# EAGLE design H3_MIDIController_Rev_1_MainBoard (EAGLE 7.6.0)
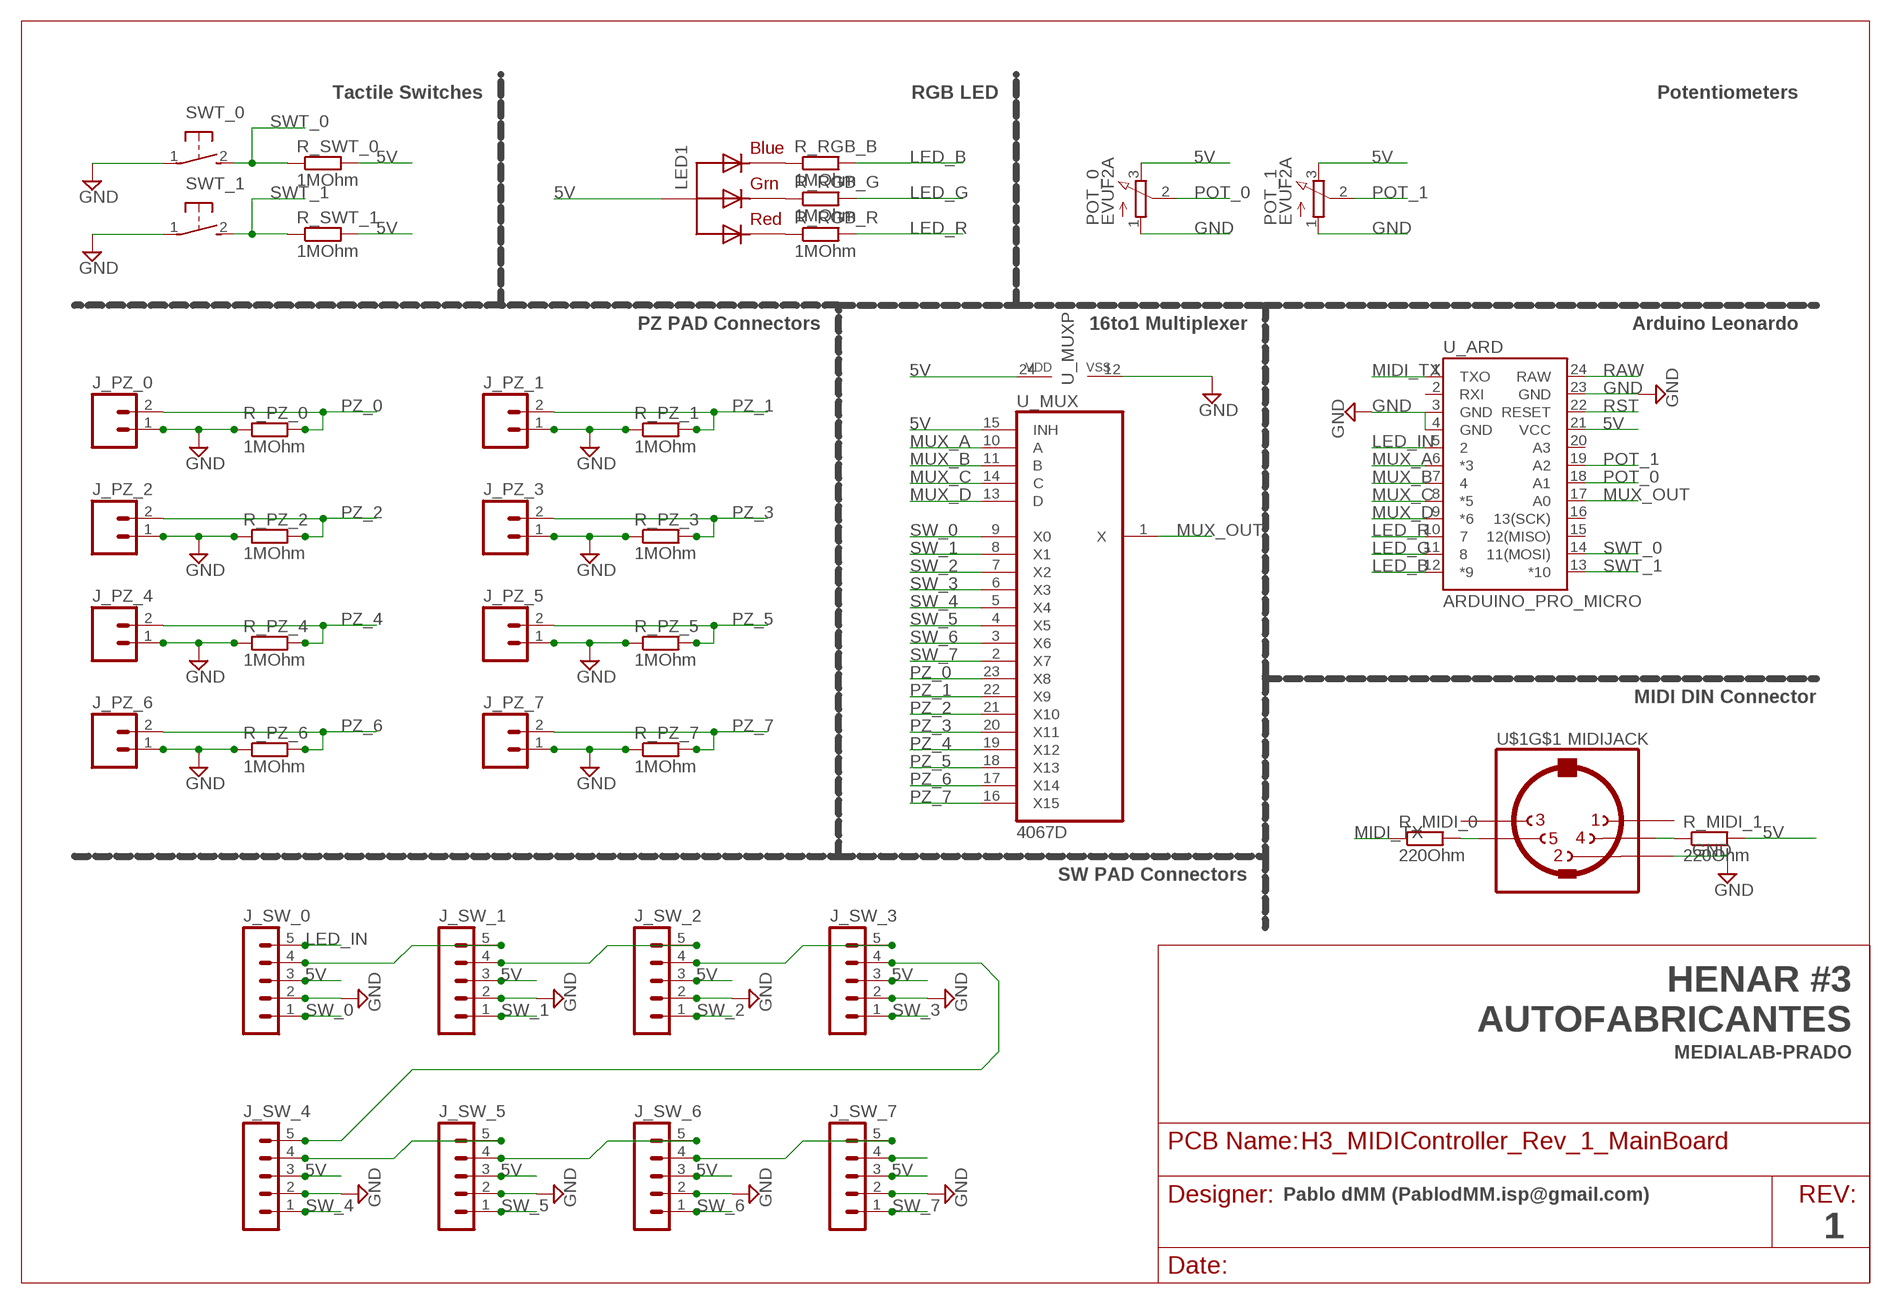
[diagram p0: schematic, sheet 1]

## Parts
J_PZ_0  MA02  [02PA]
J_PZ_1  MA02  [02PA]
J_PZ_2  MA02  [02PA]
J_PZ_3  MA02  [02PA]
J_PZ_4  MA02  [02PA]
J_PZ_5  MA02  [02PA]
J_PZ_6  MA02  [02PA]
J_PZ_7  MA02  [02PA]
J_SW_0  MA05-1  [MA05-1]
J_SW_1  MA05-1  [MA05-1]
J_SW_2  MA05-1  [MA05-1]
J_SW_3  MA05-1  [MA05-1]
J_SW_4  MA05-1  [MA05-1]
J_SW_5  MA05-1  [MA05-1]
J_SW_6  MA05-1  [MA05-1]
J_SW_7  MA05-1  [MA05-1]
LED1  RGBLED_CA-5MM  [LED5MMRGB]
POT_0  EVUF2A  [EVUF]
POT_1  EVUF2A  [EVUF]
R_MIDI_0  220Ohm  R-EU_M1206  [M1206]
R_MIDI_1  220Ohm  R-EU_M1206  [M1206]
R_PZ_0  1MOhm  R-EU_M1206  [M1206]
R_PZ_1  1MOhm  R-EU_M1206  [M1206]
R_PZ_2  1MOhm  R-EU_M1206  [M1206]
R_PZ_3  1MOhm  R-EU_M1206  [M1206]
R_PZ_4  1MOhm  R-EU_M1206  [M1206]
R_PZ_5  1MOhm  R-EU_M1206  [M1206]
R_PZ_6  1MOhm  R-EU_M1206  [M1206]
R_PZ_7  1MOhm  R-EU_M1206  [M1206]
R_RGB_B  1MOhm  R-EU_M1206  [M1206]
R_RGB_G  1MOhm  R-EU_M1206  [M1206]
R_RGB_R  1MOhm  R-EU_M1206  [M1206]
R_SWT_0  1MOhm  R-EU_M1206  [M1206]
R_SWT_1  1MOhm  R-EU_M1206  [M1206]
SWT_0  31-XX  [B3F-31XX]
SWT_1  31-XX  [B3F-31XX]
U$1  MIDIJACK  [CP-2350]
U_ARD  ARDUINO_PRO_MICRO  [ARDUINO_PRO_MICRO]
U_MUX  4067D  [SO24W]

## Nets
5V: J_SW_0.3 J_SW_1.3 J_SW_2.3 J_SW_3.3 J_SW_4.3 J_SW_5.3 J_SW_6.3 J_SW_7.3 LED1.2(VCC) POT_0.3(E) POT_1.3(E) R_MIDI_1.2 R_SWT_0.2 R_SWT_1.2 U_ARD.21(VCC) U_MUX.15(INH) U_MUX.24(VDD)
GND: J_PZ_0.1 J_PZ_1.1 J_PZ_2.1 J_PZ_3.1 J_PZ_4.1 J_PZ_5.1 J_PZ_6.1 J_PZ_7.1 J_SW_0.2 J_SW_1.2 J_SW_2.2 J_SW_3.2 J_SW_4.2 J_SW_5.2 J_SW_6.2 J_SW_7.2 POT_0.1(A) POT_1.1(A) R_PZ_0.1 R_PZ_1.1 R_PZ_2.1 R_PZ_3.1 R_PZ_4.1 R_PZ_5.1 R_PZ_6.1 R_PZ_7.1 SWT_0.1(P) SWT_1.1(P) U$1.2 U_ARD.3(GND) U_ARD.4(GND) U_ARD.23(GND) U_MUX.12(VSS)
LED_B: R_RGB_B.2 U_ARD.12(*9)
LED_G: R_RGB_G.2 U_ARD.11
LED_IN: J_SW_0.5 U_ARD.5
LED_R: R_RGB_R.2 U_ARD.10
MIDI_TX: R_MIDI_0.1 U_ARD.1(TXO)
MUX_A: U_ARD.6(*3) U_MUX.10(A)
MUX_B: U_ARD.7 U_MUX.11(B)
MUX_C: U_ARD.8(*5) U_MUX.14(C)
MUX_D: U_ARD.9(*6) U_MUX.13(D)
MUX_OUT: U_ARD.17(A0) U_MUX.1(X)
N$1: J_SW_1.4 J_SW_2.5
N$2: J_SW_0.4 J_SW_1.5
N$3: LED1.1(RED) R_RGB_R.1
N$4: J_SW_2.4 J_SW_3.5
N$5: R_MIDI_0.2 U$1.5
N$6: J_SW_3.4 J_SW_4.5
N$7: LED1.3(GREEN) R_RGB_G.1
N$8: J_SW_4.4 J_SW_5.5
N$9: J_SW_5.4 J_SW_6.5
N$10: R_MIDI_1.1 U$1.4
N$11: J_SW_6.4 J_SW_7.5
N$12: LED1.4(BLUE) R_RGB_B.1
N$13: J_SW_7.4
POT_0: POT_0.2(S) U_ARD.18(A1)
POT_1: POT_1.2(S) U_ARD.19(A2)
PZ_0: J_PZ_0.2 R_PZ_0.2 U_MUX.23(X8)
PZ_1: J_PZ_1.2 R_PZ_1.2 U_MUX.22(X9)
PZ_2: J_PZ_2.2 R_PZ_2.2 U_MUX.21(X10)
PZ_3: J_PZ_3.2 R_PZ_3.2 U_MUX.20(X11)
PZ_4: J_PZ_4.2 R_PZ_4.2 U_MUX.19(X12)
PZ_5: J_PZ_5.2 R_PZ_5.2 U_MUX.18(X13)
PZ_6: J_PZ_6.2 R_PZ_6.2 U_MUX.17(X14)
PZ_7: J_PZ_7.2 R_PZ_7.2 U_MUX.16(X15)
RAW: U_ARD.24(RAW)
RST: U_ARD.22(RESET)
SW_0: J_SW_0.1 U_MUX.9(X0)
SW_1: J_SW_1.1 U_MUX.8(X1)
SW_2: J_SW_2.1 U_MUX.7(X2)
SW_3: J_SW_3.1 U_MUX.6(X3)
SW_4: J_SW_4.1 U_MUX.5(X4)
SW_5: J_SW_5.1 U_MUX.4(X5)
SW_6: J_SW_6.1 U_MUX.3(X6)
SW_7: J_SW_7.1 U_MUX.2(X7)
SWT_0: R_SWT_0.1 SWT_0.2(S) U_ARD.14(11(MOSI))
SWT_1: R_SWT_1.1 SWT_1.2(S) U_ARD.13(*10)
Unconnected: U$1.1 U$1.3 U$1.PE1(MT) U$1.PE2(MT) U$1.PE(MT) U$1.PE@(MT) U_ARD.2(RXI) U_ARD.15(12(MISO)) U_ARD.16(13(SCK)) U_ARD.20(A3)

## Notes on the sheet
- Tactile Switches | RGB LED | Potentiometers
- PZ PAD Connectors | 16to1 Multiplexer | Arduino Leonardo
- MIDI DIN Connector
- SW PAD Connectors
- HENAR #3
  AUTOFABRICANTES
- MEDIALAB-PRADO
- Pablo dMM (PablodMM.isp@gmail.com)
- 1

## Library data of the parts
J_PZ_0 J_PZ_1-J_PZ_7 = con-amp-quick:MA02: AMP QUICK CONNECTOR; OC_FARNELL: unknown; OC_NEWARK: unknown
J_SW_0 J_SW_1-J_SW_7 = con-lstb:MA05-1: PIN HEADER; OC_FARNELL: unknown; OC_NEWARK: unknown
LED1 = adafruit:RGBLED_CA: RGB LED, common-anode 5MM Staggered pins 5mm Piranha package http://www.ladyada.net/library/pcb/eaglelibrary.html
POT_0 POT_1 = pot:EVU: 9 mm Square Rotary Potentiometers Source: Panasonic
R_MIDI_0 R_MIDI_1 R_PZ_0 R_PZ_1-R_PZ_7 R_RGB_B R_RGB_G R_RGB_R R_SWT_0 R_SWT_1 = rcl:R-EU_: RESISTOR, European symbol
SWT_0 SWT_1 = switch-omron:31-XX: OMRON SWITCH; MPN: B3F-3100; OC_FARNELL: 959704; OC_NEWARK: 36M3582
U$1 = adafruit:MIDIJACK: DIN 5 jack also known as MIDI jack A modification of conn-hirshman:MAB5SH with two options for the grounding 'teeth'
U_ARD = SparkFun-Boards:ARDUINO_PRO_MICRO
U_MUX = 40xx:4067: 16-channel ANALOG MULTIPLEXER

## Board
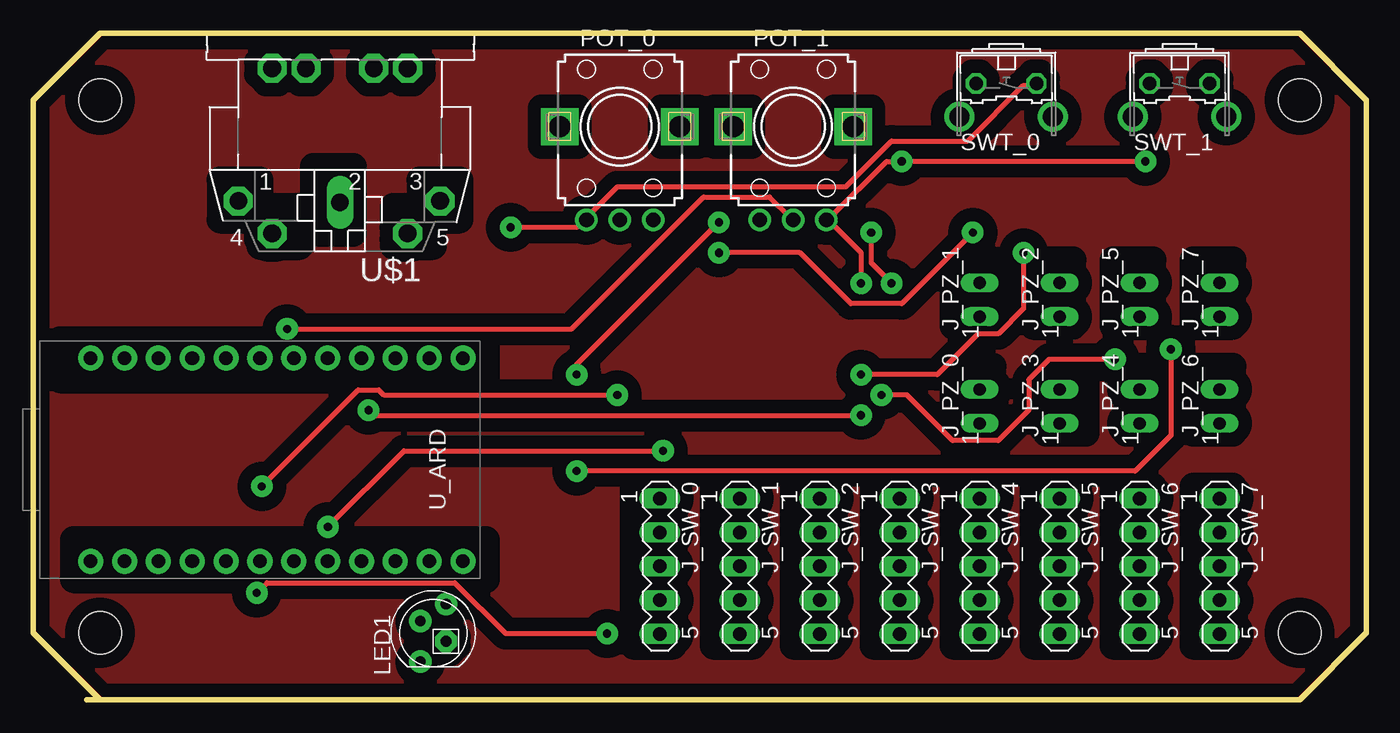
[diagram p1: board, top side]
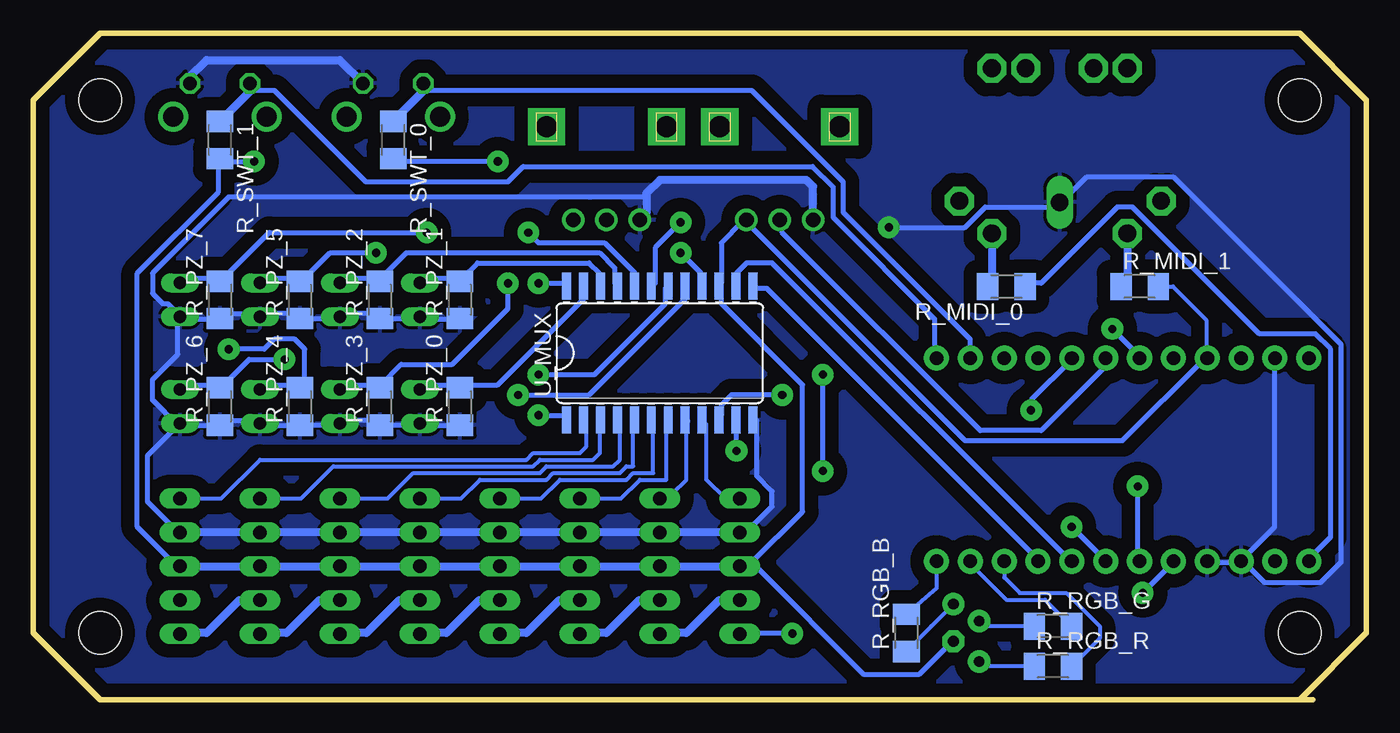
[diagram p2: board, bottom side, seen from below]

Size 100 x 50 mm. Coordinates in mm from the lower left corner, seen from the top.
Outline: 5,0 4,0 95,0
Outline: 5,0 95,0
Outline: 5,0 0,5 0,45 5,50 95,50 100,45 100,5 95,0
Copper layers (1*16): Top 0.035mm / dielectric 1.5mm / Bottom 0.035mm
Design rules "default *": minimum track width 15mil, minimum drill 24mil, track to track 15mil, track to pad 15mil, pad to pad 15mil, via to via 15mil, smd to smd 8mil, copper to edge 20mil, drill to drill 8mil, minimum pad ring 10mil, minimum via ring 20mil, stop-mask expansion 4mil, vias tented up to drill 0mil, thermal gap 10mil
Holes 3.2 mm at 5,45 5,5 95,5 95,45
tRestrict: area 2,24 to 34,27; area 3,9 to 34,12; area 45,4 to 48,16; area 51,4 to 54,16; area 57,4 to 60,16; area 63,4 to 66,16; area 69,4 to 72,16; area 75,4 to 78,16; area 81,4 to 84,16; area 87,4 to 90,16; area 69,28 to 72,33; area 75,28 to 78,33; 12 more areas
vRestrict: area 45,20 to 61,32

### Footprints (pad centres in the part's own frame; a part is rotated, then mirrored left to right if it is on the bottom)
02PA = drill 0.914 long: 1 -1.27,0; 2 1.27,0
MA05-1 = drill 1.016 long: 1 -5.08,0; 2 -2.54,0; 3 0,0; 4 2.54,0; 5 5.08,0
LED5MMRGB = drill 0.8 pad 1.676: 1 -2.159,0.968; 3 0.889,0.968; 4 2.159,-0.968 | drill 0.8 pad 1.676 octagon: 2 -0.635,-0.968
EVUF = drill 1.1 pad 1.676: 1 -2.5,-7; 2 0,-7; 3 2.5,-7 | drill 1.6 pad 2.8 square: M1 4.5,0; M2 -4.5,0
M1206 = smd 1.6 x 2: 1 -1.4,0; 2 1.4,0
B3F-31XX = drill 1.016 octagon: 1 -2.261,-1.245; 2 2.261,-1.245 | drill 1.499 pad 2.159: 3 -3.505,1.245; 4 3.505,1.245
CP-2350 = drill 1.321 pad 2.184 octagon: 1 7.62,12.58; 3 -7.52,12.58; 4 5.08,15.02; 5 -5.08,15.02; PE -2.54,2.62; PE1 -5.08,2.62; PE2 5.08,2.62; PE@ 2.54,2.62 | drill 1.321 long: 2 0,12.68
ARDUINO_PRO_MICRO = drill 1.016 pad 1.88: 1 -7.62,12.7; 2 -7.62,10.16; 3 -7.62,7.62; 4 -7.62,5.08; 5 -7.62,2.54; 6 -7.62,0; 7 -7.62,-2.54; 8 -7.62,-5.08; 9 -7.62,-7.62; 10 -7.62,-10.16; 11 -7.62,-12.7; 12 -7.62,-15.24; 13 7.62,-15.24; 14 7.62,-12.7; 15 7.62,-10.16; 16 7.62,-7.62; 17 7.62,-5.08; 18 7.62,-2.54; 19 7.62,0; 20 7.62,2.54; 21 7.62,5.08; 22 7.62,7.62; 23 7.62,10.16; 24 7.62,12.7
SO24W = smd 0.66 x 2.032: 1 -6.985,-5.029; 2 -5.715,-5.029; 3 -4.445,-5.029; 4 -3.175,-5.029; 5 -1.905,-5.029; 6 -0.635,-5.029; 7 0.635,-5.029; 8 1.905,-5.029; 9 3.175,-5.029; 10 4.445,-5.029; 11 5.715,-5.029; 12 6.985,-5.029; 13 6.985,5.029; 14 5.715,5.029; 15 4.445,5.029; 16 3.175,5.029; 17 1.905,5.029; 18 0.635,5.029; 19 -0.635,5.029; 20 -1.905,5.029; 21 -3.175,5.029; 22 -4.445,5.029; 23 -5.715,5.029; 24 -6.985,5.029

### Placement (x,y rotation side)
J_PZ_0  71,22 90 top
J_PZ_1  71,30 90 top
J_PZ_2  77,30 90 top
J_PZ_3  77,22 90 top
J_PZ_4  83,22 90 top
J_PZ_5  83,30 90 top
J_PZ_6  89,22 90 top
J_PZ_7  89,30 90 top
J_SW_0  47,10 270 top
J_SW_1  53,10 270 top
J_SW_2  59,10 270 top
J_SW_3  65,10 270 top
J_SW_4  71,10 270 top
J_SW_5  77,10 270 top
J_SW_6  83,10 270 top
J_SW_7  89,10 270 top
LED1  30,5 90 top
POT_0  44,43 0 top
POT_1  57,43 0 top
R_MIDI_0  27,31 180 bottom
R_MIDI_1  17,31 0 bottom
R_PZ_0  68,22 90 bottom
R_PZ_1  68,30 90 bottom
R_PZ_2  74,30 90 bottom
R_PZ_3  74,22 90 bottom
R_PZ_4  80,22 90 bottom
R_PZ_5  80,30 90 bottom
R_PZ_6  86,22 90 bottom
R_PZ_7  86,30 90 bottom
R_RGB_B  34.5,5 90 bottom
R_RGB_G  23.5,5.5 0 bottom
R_RGB_R  23.5,2.5 0 bottom
R_SWT_0  73,42 270 bottom
R_SWT_1  86,42 270 bottom
SWT_0  73,45 180 top
SWT_1  86,45 180 top
U$1  23,50 180 top
U_ARD  17,18 90 top
U_MUX  53,26 0 bottom

### Tracks (layer width: path | path; a pad name or v marks a point on that pad's centre or on a via)
5V  (via drill 0.61)
  Top 0.381: v62.1,31.24 62.1,33.53 59.82,35.81 POT_1.3 59.82,36.2 64.01,40.39 v65.15,40.39 v83.44,40.39
  Bottom 0.305: R_MIDI_1.2 14.5,31 12,28.5 12,25.7 U_ARD.21
  Bottom 0.381: v65.15,40.39 72.77,40.39 R_SWT_0.2 | v62.1,31.24 60.2,31.24 U_MUX.24 | J_SW_7.3 89.15,9.91 92.2,12.95 92.2,32 86.11,38.1 86.11,40.39 R_SWT_1.2 85.72,40.39 v83.44,40.39 | LED1.2 31.24,4.19 33.53,1.91 37.72,1.91 45.72,9.91 J_SW_0.3 46.1,10.29 42.29,14.1 42.29,23.62 48.39,29.72 48.39,30.86 U_MUX.15 48.39,31.24 48.39,34.29 46.86,35.81 POT_0.3 46.48,35.81 30.1,19.43 18.29,19.43 12.19,25.53 U_ARD.21
  Bottom 0.61: J_SW_7.3 J_SW_6.3 J_SW_5.3 J_SW_4.3 J_SW_3.3 J_SW_2.3 J_SW_1.3 J_SW_0.3 46,10
GND  (via drill 0.61)
  Top 0.381: v35.81,35.43 40.77,35.43 41.15,35.81 POT_0.1 41.53,36.2 43.81,38.48 60.96,38.48 64.39,41.91 70.1,41.91 74.3,46.1 75.06,46.1 SWT_0.1
  Bottom 0.381: J_PZ_7.1 88.77,28.57 86.11,28.57 R_PZ_7.1 85.72,28.96 83.06,28.96 J_PZ_5.1 82.68,28.96 80.01,28.96 R_PZ_5.1 79.63,28.57 77.34,28.57 J_PZ_2.1 76.96,28.96 74.3,28.96 R_PZ_2.1 73.91,28.57 71.25,28.57 J_PZ_1.1 70.87,28.57 68.2,28.57 R_PZ_1.1 | R_PZ_0.1 68.2,20.57 70.87,20.57 J_PZ_0.1 71.25,20.57 73.91,20.57 R_PZ_3.1 74.3,20.95 76.96,20.95 J_PZ_3.1 77.34,20.57 79.63,20.57 R_PZ_4.1 80.01,20.57 82.68,20.57 J_PZ_4.1 83.06,20.95 85.72,20.95 R_PZ_6.1 86.11,20.57 88.77,20.57 J_PZ_6.1 89.15,20.57 | U_MUX.12 45.72,20.95 45.72,16.76 44.58,15.62 44.58,14.48 46.86,12.19 J_SW_0.2 | 89.15,20.57 91.44,18.29 91.44,14.86 89.15,12.57 J_SW_7.2 | 89.15,20.57 91.06,22.48 91.06,24 89.15,25.91 89.15,28.57 J_PZ_7.1 | U_ARD.3 9.53,10.29 11.81,10.29 U_ARD.4 | U_ARD.23 6.86,25.53 6.86,12.95 9.14,10.67 U_ARD.3 | v35.81,35.43 30.1,35.43 28.57,36.96 23.24,36.96 U$1.2 22.86,37.34 20.95,39.24 14.48,39.24 1.91,26.67 1.91,10.29 3.43,8.76 7.62,8.76 9.14,10.29 U_ARD.3 | J_PZ_7.1 89.15,28.96 89.92,29.72 90.3,29.72 91.06,30.48 91.06,32 85.34,37.72 54.1,37.72 54,38
  Bottom 0.61: J_SW_0.2 J_SW_1.2 J_SW_2.2 J_SW_3.2 J_SW_4.2 J_SW_5.2 J_SW_6.2 J_SW_7.2 | SWT_1.1 88.26,46.74 87,48 77.02,48 SWT_0.1 | POT_0.1 41.5,38.5 42,39 53,39 54,38 54,36.5 POT_1.1
  pour Bottom (isolate 1.016): 0,45 5,50 95,50 100,45 100,5 95,0 5,0 0,5
LED_B
  Bottom 0.305: U_ARD.12 32.24,8.36 R_RGB_B.2
LED_G
  Bottom 0.305: U_ARD.11 29.7,10.2 27,7.5 24.1,7.5 R_RGB_G.2
LED_IN  (via drill 0.61)
  Top 0.381: v43.05,4.95 35.43,4.95 31.62,8.76 17.53,8.76 v16.76,8
  Bottom 0.381: v43.05,4.95 46.86,4.95 J_SW_0.5 | v16.76,8 14.48,10.29 U_ARD.5
LED_R
  Bottom 0.305: U_ARD.10 27.16,9.16 26,8 22.5,8 20,5.5 20,4.6 R_RGB_R.2
MIDI_TX
  Bottom 0.381: R_MIDI_0.1 25.53,31.24 24.38,31.24 18.67,36.96 17.53,36.96 8,27.43 3.81,27.43 2.67,26.29 2.67,12.19 4.19,10.67 U_ARD.1
MUX_A  (via drill 0.61)
  Top 0.381: v43.81,22.86 26.29,22.86 25.91,23.24 24.38,23.24 v17.14,16
  Bottom 0.381: v43.81,22.86 47.62,22.86 48.39,22.1 48.39,21.34 U_MUX.10 | v17.14,16 17.14,10.67 U_ARD.6
MUX_B  (via drill 0.61)
  Top 0.381: v47.24,18.67 27.81,18.67 v22.1,12.95
  Bottom 0.381: v47.24,18.67 47.24,20.95 U_MUX.11 | v22.1,12.95 19.81,10.67 U_ARD.7
MUX_C
  Bottom 0.381: U_MUX.14 47.24,31.24 47.24,32 46.48,32.77 44.58,32.77 22.1,10.29 U_ARD.8
MUX_D
  Bottom 0.381: U_MUX.13 45.72,30.86 44.96,30.86 24.77,10.67 U_ARD.9
MUX_OUT  (via drill 0.61)
  Top 0.381: v62.1,21.34 25.53,21.34 v25.15,21.72
  Bottom 0.381: v62.1,21.34 60.2,21.34 U_MUX.1 | v25.15,21.72 25.15,22.48 22.1,25.53 U_ARD.17
N$1
  Bottom 0.61: J_SW_1.4 54.54,7.46 57,5 58.92,5 J_SW_2.5
N$2
  Bottom 0.61: J_SW_0.4 48.54,7.46 51,5 52.92,5 J_SW_1.5
N$3
  Bottom 0.305: R_RGB_R.1 28.69,2.5 LED1.1
N$4
  Bottom 0.61: J_SW_2.4 60.54,7.46 63,5 64.92,5 J_SW_3.5
N$5
  Bottom 0.61: U$1.5 28.08,31.32 R_MIDI_0.2
N$6
  Bottom 0.61: J_SW_3.4 66.54,7.46 69,5 70.92,5 J_SW_4.5
N$7
  Bottom 0.305: R_RGB_G.1 28.64,5.5 LED1.3
N$8
  Bottom 0.61: J_SW_4.4 72.54,7.46 75,5 76.92,5 J_SW_5.5
N$9
  Bottom 0.61: J_SW_5.4 78.54,7.46 81,5 82.92,5 J_SW_6.5
N$10
  Bottom 0.61: U$1.4 17.92,31.48 R_MIDI_1.1
N$11
  Bottom 0.61: J_SW_6.4 84.54,7.46 87,5 88.92,5 J_SW_7.5
N$12
  Bottom 0.305: R_RGB_B.1 32.63,5.5 LED1.4
N$14
  pour Top (isolate 1.016): 0,45 5,50 95,50 100,45 100,5 95,0 5,0 0,5
N$15
  pour Bottom (isolate 1.016): 0,45 5,50 95,50 100,45 100,5 95,0 5,0 0,5
POT_0
  Bottom 0.381: POT_0.2 43.81,35.81 43.81,35.05 28.96,20.19 24.38,20.19 19.81,24.77 19.81,25.53 U_ARD.18
POT_1  (via drill 0.61)
  Top 0.381: v19.05,27.81 40.39,27.81 50.29,37.72 55.24,37.72 56.77,36.2 POT_1.2
  Bottom 0.381: v19.05,27.81 17.14,25.91 U_ARD.19
PZ_0
  Bottom 0.381: J_PZ_0.2 70.87,23.62 68.2,23.62 R_PZ_0.2 67.82,23.62 65.15,23.62 58.67,30.1 58.67,30.86 U_MUX.23
PZ_1
  Bottom 0.381: J_PZ_1.2 70.87,31.62 68.2,31.62 R_PZ_1.2 67.82,31.62 66.67,32.77 58.29,32.77 57.53,32 57.53,31.24 U_MUX.22
PZ_2
  Bottom 0.381: J_PZ_2.2 76.96,31.62 74.3,31.62 R_PZ_2.2 73.91,31.62 72.01,33.53 57.53,33.53 56.39,32.38 56.39,31.24 U_MUX.21
PZ_3  (via drill 0.61)
  Top 0.381: v62.87,35.05 62.87,32.77 v64.39,31.24
  Bottom 0.381: J_PZ_3.2 76.96,23.62 74.3,23.62 R_PZ_3.2 73.91,23.62 72.39,25.15 68.58,25.15 64.39,29.34 v64.39,31.24 | v62.87,35.05 62.1,34.29 57.15,34.29 54.86,32 54.86,31.24 U_MUX.20
PZ_4  (via drill 0.61)
  Top 0.381: v51.44,35.81 40.77,25.15 v40.77,24.38 | v40.77,17.14 82.68,17.14 85.34,19.81 v85.34,26.29
  Bottom 0.381: J_PZ_4.2 82.68,23.62 80.01,23.62 R_PZ_4.2 79.63,23.62 79.63,26.29 80.39,27.05 81.92,27.05 82.68,26.29 v85.34,26.29 | v51.44,35.81 53.34,33.91 53.34,31.24 U_MUX.19 | v40.77,17.14 v40.77,24.38
PZ_5  (via drill 0.61)
  Top 0.381: v62.1,24.38 67.82,24.38 70.87,27.43 72.39,27.43 74.3,29.34 v74.3,33.53
  Bottom 0.381: J_PZ_5.2 82.68,31.62 80.01,31.62 R_PZ_5.2 79.63,31.62 77.72,33.53 v74.3,33.53 | v62.1,24.38 57.91,24.38 52.58,29.72 52.58,30.86 U_MUX.18
PZ_6  (via drill 0.61)
  Top 0.381: v63.63,22.86 65.53,22.86 68.96,19.43 72.39,19.43 74.68,21.72 74.68,24 76.2,25.53 v81.15,25.53
  Bottom 0.381: J_PZ_6.2 88.77,23.62 86.11,23.62 R_PZ_6.2 85.72,23.62 83.82,25.53 v81.15,25.53 | v63.63,22.86 58.29,22.86 51.05,30.1 51.05,30.86 U_MUX.17
PZ_7  (via drill 0.61)
  Top 0.381: v51.44,33.53 57.53,33.53 61.34,29.72 65.15,29.72 v70.48,35.05
  Bottom 0.381: J_PZ_7.2 88.77,31.62 86.11,31.62 R_PZ_7.2 85.72,31.62 82.3,35.05 v70.48,35.05 | v51.44,33.53 49.91,32 49.91,31.24 U_MUX.16
SW_0
  Bottom 0.305: J_SW_0.1 48.08,15.08 49.5,16.5 49.5,20.65 U_MUX.9
SW_1
  Bottom 0.305: 53,15.5 52,15.5 51,16.5 51,20.88
  Bottom 0.61: J_SW_1.1 53,15.5 | 51,20.88 U_MUX.8
SW_2
  Bottom 0.305: J_SW_2.1 55.92,15.08 54.5,16.5 52.5,16.5 52.5,20.84 U_MUX.7
SW_3
  Bottom 0.305: J_SW_3.1 61.92,15.08 60.5,16.5 55.5,16.5 55,17 53.5,17 53.5,20.84 U_MUX.6
SW_4
  Bottom 0.305: J_SW_4.1 67.92,15.08 66.5,16.5 61.5,16.5 61,17 56,17 55.5,17.5 55,17.5 55,20.88 U_MUX.5
SW_5
  Bottom 0.305: J_SW_5.1 73.42,15.08 71.5,17 62,17 61.5,17.5 56.5,17.5 56,18 56,20.8 U_MUX.4
SW_6
  Bottom 0.305: J_SW_6.1 79.92,15.08 77.5,17.5 62.5,17.5 62,18 58,18 57.5,18.5 57.5,20.92 U_MUX.3
SW_7
  Bottom 0.305: J_SW_7.1 85.92,15.08 83,18 63,18 62.5,18.5 59,18.5 58.5,19 58.5,20.76 U_MUX.2
SWT_0
  Bottom 0.381: U_ARD.14 29.72,25.91 29.72,27.05 39.24,36.58 39.24,38.86 46.1,45.72 70.48,45.72 SWT_0.2
  Bottom 0.61: SWT_0.2 70.74,45.66 R_SWT_0.1
SWT_1
  Bottom 0.381: U_ARD.13 32.38,25.91 32.38,28.57 40.01,36.2 40.01,38.48 41.53,40.01 63.25,40.01 64.39,38.86 75.06,38.86 81.92,45.72 83.44,45.72 SWT_1.2
  Bottom 0.61: SWT_1.2 83.74,45.66 R_SWT_1.1